# Altium schematic sheet 04_POWER_V1-0.SchDoc: RPi GS CAM SER.
size A3; Date: 2023-05-29; Author: M. Weimann; Organization: Altium Limited; Revision: 1.0; SheetNumber: 5; SheetTotal: 5; Title_Subtitle: Power Supplies; Language: DE; Department: F&E; Filename: RPi-GS-CAM-SER_PCB_V1-0.PDF; Project: PI-0017; DocType: Stromlauf; ItemNo-PCB: n/a
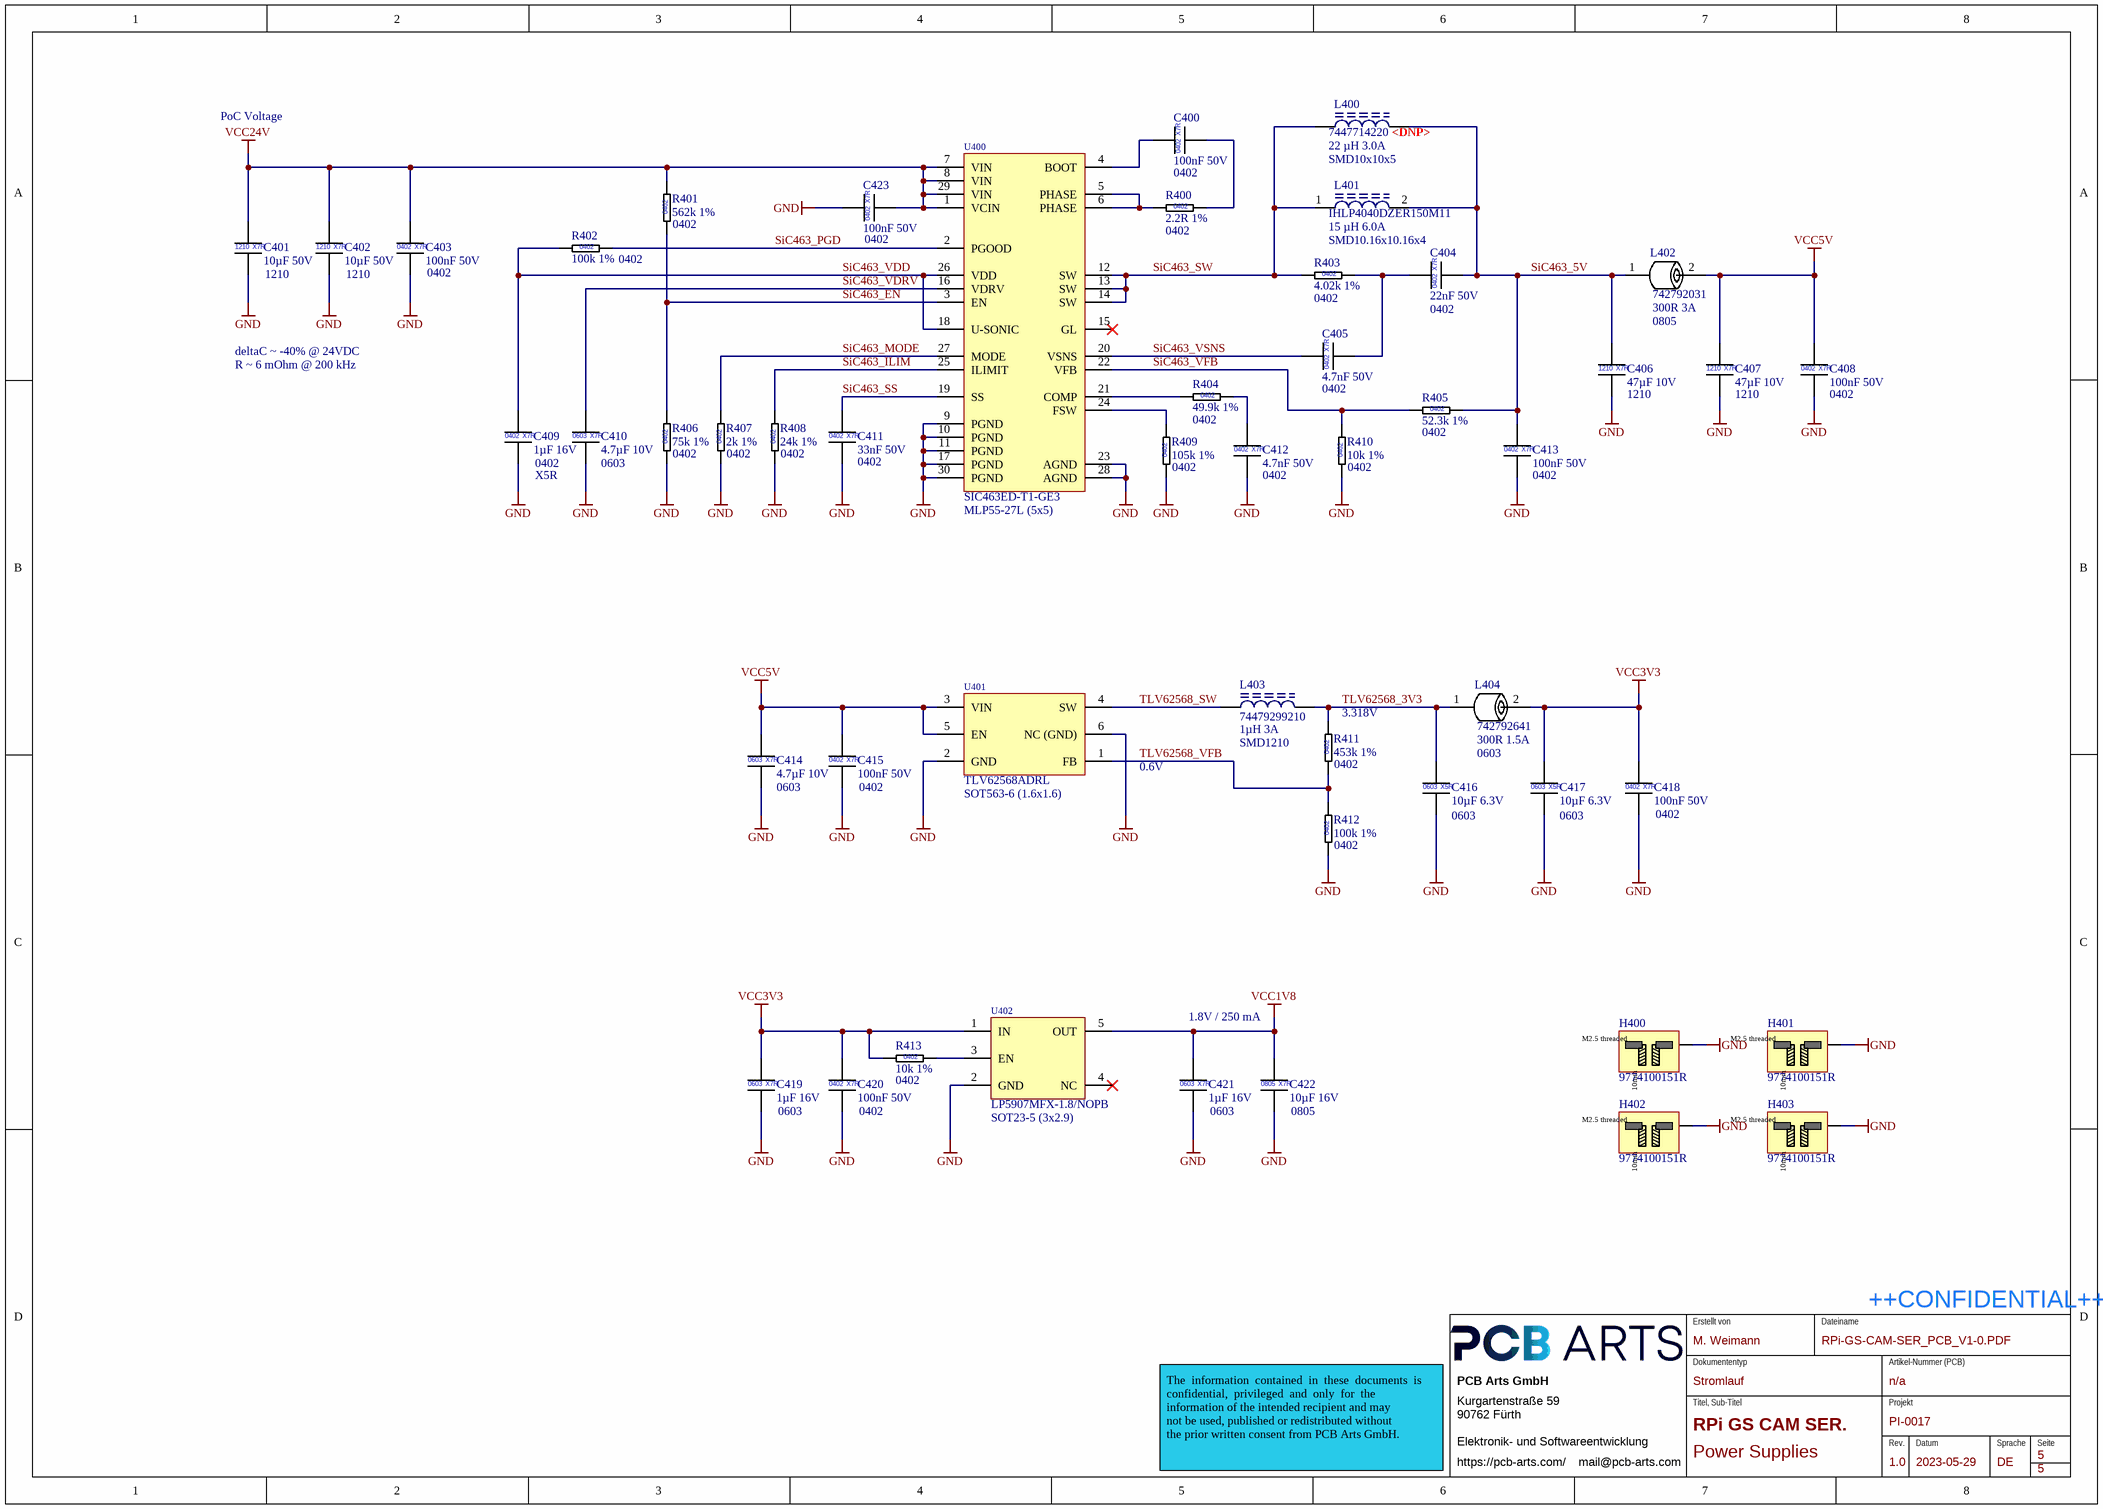
[diagram p0: 04_POWER_V1-0.SchDoc]

## Parts
C400  100nF 50V  [CAP_0402_L]
C401  10µF 50V  [CAP_1210]
C402  10µF 50V  [CAP_1210]
C403  100nF 50V  [CAP_0402_L]
C404  22nF 50V  [CAP_0402_L]
C405  4.7nF 50V  [CAP_0402_L]
C406  47µF 10V  [CAP_1210]
C407  47µF 10V  [CAP_1210]
C408  100nF 50V  [CAP_0402_L]
C409  1µF 16V  [CAP_0402_L]
C410  4.7µF 10V  [CAP_0603_L]
C411  33nF 50V  [CAP_0402_L]
C412  4.7nF 50V  [CAP_0402_L]
C413  100nF 50V  [CAP_0402_L]
C414  4.7µF 10V  [CAP_0603_L]
C415  100nF 50V  [CAP_0402_L]
C416  10µF 6.3V  [CAP_0603_L]
C417  10µF 6.3V  [CAP_0603_L]
C418  100nF 50V  [CAP_0402_L]
C419  1µF 16V  [CAP_0603_L]
C420  100nF 50V  [CAP_0402_L]
C421  1µF 16V  [CAP_0603_L]
C422  10µF 16V  [CAP_0805]
C423  100nF 50V  [CAP_0402_L]
H400  9774100151R  [9774100151R]
H401  9774100151R  [9774100151R]
H402  9774100151R  [9774100151R]
H403  9774100151R  [9774100151R]
L400  7447714220  [WE-PD_1050]  (no BOM)
L401  IHLP4040DZER150M11  [IHLP-4040DZ-11]
L402  742792031  [L_0805]
L403  74479299210  [WE-PMCI_1210]
L404  742792641  [L_0603]
R400  2.2R 1%  [RES_0402_L]
R401  562k 1%  [RES_0402_L]
R402  100k 1%  [RES_0402_L]
R403  4.02k 1%  [RES_0402_L]
R404  49.9k 1%  [RES_0402_L]
R405  52.3k 1%  [RES_0402_L]
R406  75k 1%  [RES_0402_L]
R407  2k 1%  [RES_0402_L]
R408  24k 1%  [RES_0402_L]
R409  105k 1%  [RES_0402_L]
R410  10k 1%  [RES_0402_L]
R411  453k 1%  [RES_0402_L]
R412  100k 1%  [RES_0402_L]
R413  10k 1%  [RES_0402_L]
U400  SIC463ED-T1-GE3  [VISHAY_MLP55-27L]
U401  TLV62568ADRL  [SON50P150X80-6N]
U402  LP5907MFX-1.8/NOPB  [SOT95P285X140-5N]

## Nets
GND: C401.2 C402.2 C403.2 C406.2 C407.2 C408.2 C409.2 C410.2 C411.2 C412.2 C413.2 C414.2 C415.2 C416.2 C417.2 C418.2 C419.2 C420.2 C421.2 C422.2 C423.1 H400.1 H401.1 H402.1 H403.1 R406.1 R407.1 R408.1 R409.1 R410.1 R412.1 U400.9(PGND) U400.10(PGND) U400.11(PGND) U400.17(PGND) U400.23(AGND) U400.28(AGND) U400.30(PGND) U401.2(GND) U401.6(NC_(GND)) U402.2(GND)
VCC1V8: C421.1 C422.1 U402.5(OUT)
VCC3V3: C417.1 C418.1 C419.1 C420.1 L404.2 R413.1 U402.1(IN)
VCC5V: C407.1 C408.1 C414.1 C415.1 L402.2 U401.3(VIN) U401.5(EN)
VCC24V: C401.1 C402.1 C403.1 C423.2 R401.2 U400.1(VCIN) U400.7(VIN) U400.8(VIN) U400.29(VIN)
SiC463_5V: C404.2 C406.1 C413.1 L400.2 L401.2 L402.1 R405.2
SiC463_EN: R401.1 R406.2 U400.3(EN)
SiC463_ILIM: R408.2 U400.25(ILIMIT)
SiC463_MODE: R407.2 U400.27(MODE)
SiC463_PGD: R402.2 U400.2(PGOOD)
SiC463_SS: C411.1 U400.19(SS)
SiC463_SW: L400.1 L401.1 R403.1 U400.12(SW) U400.13(SW) U400.14(SW)
SiC463_VDD: C409.1 R402.1 U400.18(U-SONIC) U400.26(VDD)
SiC463_VDRV: C410.1 U400.16(VDRV)
SiC463_VFB: R405.1 R410.2 U400.22(VFB)
SiC463_VSNS: C405.1 U400.20(VSNS)
TLV62568_3V3: C416.1 L403.2 L404.1 R411.2
TLV62568_SW: L403.1 U401.4(SW)
TLV62568_VFB: R411.1 R412.2 U401.1(FB)
NetC400_1: C400.1 U400.4(BOOT)
NetC400_2: C400.2 R400.2
NetC404_1: C404.1 C405.2 R403.2
NetC412_1: C412.1 R404.2
NetR400_1: R400.1 U400.5(PHASE) U400.6(PHASE)
NetR404_1: R404.1 U400.21(COMP)
NetR409_2: R409.2 U400.24(FSW)
NetR413_2: R413.2 U402.3(EN)

Not connected (* = marked no-connect by the designer): U400 15(GL)*; U402 4(NC)*

## Notes on the sheet
- PoC Voltage
- 0402
- (near L400) 22 µH 3.0A
- SMD10x10x5
- (near L400) <DNP>
- (near R401) 0402
- (near C423) 0402
- (near R400) 0402
- (near L401) 15 µH 6.0A
- SMD10.16x10.16x4
- (near C401) 1210
- (near C402) 1210
- (near C403) 0402
- (near R402) 0402
- (near R403) 0402
- (near C404) 0402
- (near L402) 300R 3A
- deltaC ~ -40% @ 24VDC
- R ~ 6 mOhm @ 200 kHz
- 0805
- (near R405) 0402
- (near C406) 1210
- (near C407) 1210
- (near C408) 0402
- X5R
- (near C410) 0603
- (near R406) 0402
- (near R407) 0402
- (near R408) 0402
- (near C411) 0402
- (near U400) MLP55-27L (5x5)
- (near R409) 0402
- (near C412) 0402
- (near R410) 0402
- (near C413) 0402
- (near R411) 3.318V
- 0.6V
- (near L403) 1µH 3A
- SMD1210
- (near R411) 0402
- 300R 1.5A
- 0603
- (near C414) 0603
- (near C415) 0402
- (near U401) SOT563-6 (1.6x1.6)
- (near R412) 0402
- (near C416) 0603
- (near C417) 0603
- (near C418) 0402
- 1.8V / 250 mA
- (near C419) 0603
- (near C420) 0402
- (near R413) 0402
- (near U402) SOT23-5 (3x2.9)
- (near C421) 0603
- (near C422) 0805
- Erstellt von
- Dateiname
- ++CONFIDENTIAL++
- PCB Arts GmbH
- Dokumententyp
- Artikel-Nummer (PCB)
- Kurgartenstraße 59
- 90762 Fürth
- Elektronik- und Softwareentwicklung
- Titel, Sub-Titel
- Projekt
- Rev.
- Datum
- Sprache
- Seite
- The  information  contained  in  these  documents  is  confidential,  privileged  and  only  for  the
  information of the intended recipient and may
  not be used, published or redistributed without
  the prior written consent from PCB Arts GmbH.
- https://pcb-arts.com/
- mail@pcb-arts.com
- (in symbol CAP_0402_1µF_16V) 0402; X7R
- (in symbol CAP_0402_4.7nF_50V_X7R_10%) X7R; 0402
- (in symbol CAP_0402_22nF_50V) X7R; 0402
- (in symbol CAP_0402_33nF_50V) 0402; X7R
- (in symbol CAP_0402_100nF_50V) 0402; X7R
- (in symbol CAP_0603_1µF_16V_X7R_10%) 0603; X7R
- (in symbol CAP_0603_4.7µF_10V_X7R_10%) 0603; X7R
- (in symbol CAP_0603_10µF_6.3V) 0603; X5R
- (in symbol CAP_0805_10µF_16V_X7R_10%) 0805; X7R
- (in symbol CAP_1210_10µF_50V_X7R_10%) 1210; X7R
- (in symbol CAP_1210_47µF_10V_X7R_10%) 1210; X7R
- (in symbol RES_0402_2.2R_1%) 0402
- (in symbol RES_0402_2k_1%) 0402
- (in symbol RES_0402_4.02k_1%) 0402
- (in symbol RES_0402_10k_1%) 0402
- (in symbol RES_0402_24k_1%) 0402
- (in symbol RES_0402_49.9k_1%) 0402
- (in symbol RES_0402_52.3k_1%) 0402
- (in symbol RES_0402_75k_1%) 0402
- (in symbol RES_0402_100k_1%) 0402
- (in symbol RES_0402_105k_1%) 0402
- (in symbol RES_0402_453k_1%) 0402
- (in symbol RES_0402_562k_1%) 0402
- (in symbol Würth Standoff M2.5 h:10mm) M2.5 threaded; 10mm

## Library data of the parts
C400 C403 C408 C413 C415 C418 C420 C423 = CAP_0402_100nF_50V: Multilayer Ceramic Capacitors MLCC - SMD/SMT 0402 50VDC; Manufacturer 1: Murata Electronics; Manufacturer 1 Prt. Nr.: GCM155L8EH104KE07D; Manufacturer 2 Prt. Nr.: UMK105B7104KV-FR; Manufacturer 2: TDK
C401 C402 = CAP_1210_10µF_50V_X7R_10%: Multilayer Ceramic Capacitors MLCC - SMD/SMT 10 uF 50 VDC 10% 1210 X7R; Manufacturer 1: Murata Electronics; Manufacturer 1 Prt. Nr.: GRJ32ER71H106KE11L; Manufacturer 2 Prt. Nr.: C1210C106K5RACTU; Manufacturer 2: KEMET
C404 = CAP_0402_22nF_50V: Multilayer Ceramic Capacitors MLCC - SMD/SMT 0402 50VDC; Manufacturer 1: Murata; Manufacturer 1 Prt. Nr.: GRT155R71H223KE01D; Manufacturer 2 Prt. Nr.: 0402B223K500CT; Manufacturer 2: Walsin
C405 C412 = CAP_0402_4.7nF_50V_X7R_10%: Multilayer Ceramic Capacitors MLCC - SMD/SMT 50V 0.022uF X7R 0402 10%; Manufacturer 1: Murata Electronics; Manufacturer 1 Prt. Nr.: GCM155R71H472KA37J; Manufacturer 2 Prt. Nr.: C0402C472K5RAC7411; Manufacturer 2: KEMET
C406 C407 = CAP_1210_47µF_10V_X7R_10%: Multilayer Ceramic Capacitors MLCC - SMD/SMT 47 uF 10 VDC 10% 1210 X7R; Manufacturer 1: Murata Electronics; Manufacturer 1 Prt. Nr.: GRM32ER71A476KE15L; Manufacturer 2 Prt. Nr.: C1210C106K8RACTU; Manufacturer 2: KEMET
C409 = CAP_0402_1µF_16V: Multilayer Ceramic Capacitors MLCC - SMD/SMT 0402 16VDC; Manufacturer 1: Taiyo Yuden; Manufacturer 1 Prt. Nr.: EMK105BJ105MVHF; Manufacturer 2 Prt. Nr.: GRM155R61E105KA12D; Manufacturer 2: Murata Electronics
C410 C414 = CAP_0603_4.7µF_10V_X7R_10%: Multilayer Ceramic Capacitors MLCC - SMD/SMT 4.7 uF 10 VDC 10% 0603 X7R; Manufacturer 1: Murata Electronics; Manufacturer 1 Prt. Nr.: GRM188Z71A475KE15D; Manufacturer 2 Prt. Nr.: 0603B475K100NT; Manufacturer 2: FH (Guangdong Fenghua Advanced Tech)
C411 = CAP_0402_33nF_50V: Multilayer Ceramic Capacitors MLCC - SMD/SMT 0402 50VDC; Manufacturer 1: Murata; Manufacturer 1 Prt. Nr.: GRT155R71H333KE01D; Manufacturer 2 Prt. Nr.: CC0402KRX7R9BB333; Manufacturer 2: Yageo
C416 C417 = CAP_0603_10µF_6.3V: Multilayer Ceramic Capacitors MLCC - SMD/SMT 0603 6.3VDC; Manufacturer 1: Murata Electronics; Manufacturer 1 Prt. Nr.: GRM188R60J106ME84J; Manufacturer 2 Prt. Nr.: JMK107ABJ106MA-T; Manufacturer 2: Taiyo Yuden
C419 C421 = CAP_0603_1µF_16V_X7R_10%: Multilayer Ceramic Capacitors MLCC - SMD/SMT 0603 16VDC 1uF 10% X7R 0.8mm; Manufacturer 1: TDK; Manufacturer 1 Prt. Nr.: C1608X7R1C105K080AC; Manufacturer 2 Prt. Nr.: C0603C105K4RACTU; Manufacturer 2: KEMET
C422 = CAP_0805_10µF_16V_X7R_10%: Multilayer Ceramic Capacitors MLCC - SMD/SMT 16V 10uF X7R 0805 10%; Manufacturer 1: KYOCERA AVX; Manufacturer 1 Prt. Nr.: 0805YC106KAT2A; Manufacturer 2 Prt. Nr.: CL21B106KOQNNNG; Manufacturer 2: Samsung Electro-Mechanics
H400-H403 = Würth Standoff M2.5 h:10mm: Würth Standoff M2.5 h:10mm 9774050151R; Manufacturer 1: Würth Elektronik; Manufacturer 1 Prt. Nr.: 9774100151R
L400 = 7447714220_22uH_20%_3.0A_50mΩ_SMD: Power Inductors - SMD WE-PD 22uH 3A DCR=50mOhms; Manufacturer 1: Wurth Elektronik; Manufacturer 1 Prt. Nr.: 7447714220; ClassName: ComponentsOverlap
L401 = IHLP4040DZER150M11_15uH_20%_6.0A_45mΩ_SMD: 15uH ±20% 6A 45mΩ SMD,10.16x10.16x4mm Power Inductor; Manufacturer 1: Visay Dale; Manufacturer 1 Prt. Nr.: IHLP4040DZER150M11; ClassName: ComponentsOverlap
L402 = 742792031 _Ferrite_Beads_0805_300Ohms_3000mA: Ferrite Beads WE-CBF 0805 200MHz 300Ohm 3000mA AEC-Q200; Manufacturer 1: Wurth Elektronik; Manufacturer 1 Prt. Nr.: 742792031
L403 = 74479299210_Fixed_Inductors_1.0uH_30%_3A_SMD1210: Fixed Power Inductor - SMD WE-PMCI 1210 1.0uH 3A 38mOhms 30%Tol; Manufacturer 1: Wurth Elektronik; Manufacturer 1 Prt. Nr.: 74479299210
L404 = 742792641_Ferrite_Beads_0603_300Ohms_1500mA: Ferrite Beads WE-CBF 0603 100MHz 300Ohm 2000mA AEC-Q200; Manufacturer 1: Wurth Elektronik; Manufacturer 1 Prt. Nr.: 742792641
R400 = RES_0402_2.2R_1%: Thick Film Resistors - SMD 2.2Ohm 1%; Manufacturer 1: Vishay / Dale; Manufacturer 1 Prt. Nr.: CRCW04022R20JNED; Manufacturer 2 Prt. Nr.: RC0402FR-7W2R2L; Manufacturer 2: Yageo
R401 = RES_0402_562k_1%: Thick Film Resistors - SMD 562kOhms 62.5mW 0402 1%; Manufacturer 1: Vishay / Dale; Manufacturer 1 Prt. Nr.: CRCW0402562KFKEDC; Manufacturer 2 Prt. Nr.: AC0402FR-07562KL; Manufacturer 2: Yageo
R402 R412 = RES_0402_100k_1%: Thick Film Resistors - SMD 100kOhm 1%; Manufacturer 1: Vishay / Dale; Manufacturer 1 Prt. Nr.: CRCW0402100KFKEDC; Manufacturer 2 Prt. Nr.: RC0402FR-7W100KL; Manufacturer 2: Yageo
R403 = RES_0402_4.02k_1%: Thick Film Resistors - SMD 4.02kOhm 1%; Manufacturer 1: Vishay / Dale; Manufacturer 1 Prt. Nr.: CRCW04024K02FKEDC; Manufacturer 2 Prt. Nr.: RC0402FR-134K02L; Manufacturer 2: Yageo
R404 = RES_0402_49.9k_1%: Thick Film Resistors - SMD 49.9kOhm 1%; Manufacturer 1: Vishay / Dale; Manufacturer 1 Prt. Nr.: CRCW040249K9FKEDC; Manufacturer 2 Prt. Nr.: RC0402FR-7W49K9L; Manufacturer 2: Yageo
R405 = RES_0402_52.3k_1%: Thick Film Resistors - SMD 52.3kOhm 1%; Manufacturer 1: Vishay / Dale; Manufacturer 1 Prt. Nr.: CRCW040252K3FKEDC; Manufacturer 2 Prt. Nr.: RC0402FR-1352K3L; Manufacturer 2: Yageo
R406 = RES_0402_75k_1%: Thick Film Resistors - SMD 75kOhm 1%; Manufacturer 1: Vishay / Dale; Manufacturer 1 Prt. Nr.: CRCW040275K0FKEDC; Manufacturer 2 Prt. Nr.: AC0402FR-0775KL; Manufacturer 2: Yageo
R407 = RES_0402_2k_1%: Thick Film Resistors - SMD 2 kOhms 62.5mW 0402 1%; Manufacturer 1: Vishay / Dale; Manufacturer 1 Prt. Nr.: CRCW04022K00FKEDC; Manufacturer 2 Prt. Nr.: RC0402FR-072KL; Manufacturer 2: Yageo
R408 = RES_0402_24k_1%: Thick Film Resistors - SMD 24kOhm 1%; Manufacturer 1: Vishay / Dale; Manufacturer 1 Prt. Nr.: CRCW040224K0FKEDC; Manufacturer 2 Prt. Nr.: RC0402FR-7W24KL; Manufacturer 2: Yageo
R409 = RES_0402_105k_1%: Thick Film Resistors - SMD 105kOhm 1%; Manufacturer 1: Vishay / Dale; Manufacturer 1 Prt. Nr.: CRCW0402105KFKEDC; Manufacturer 2 Prt. Nr.: RC0402FR-13105KL; Manufacturer 2: Yageo
R410 R413 = RES_0402_10k_1%: Thick Film Resistors - SMD 10kOhm 1%; Manufacturer 1: Vishay / Dale; Manufacturer 1 Prt. Nr.: CRCW040210K0FKEDC; Manufacturer 2 Prt. Nr.: RC0402FR-7W10KL; Manufacturer 2: Yageo
R411 = RES_0402_453k_1%: Thick Film Resistors - SMD 1/16watt 453Kohms 1%; Manufacturer 1: Vishay / Dale; Manufacturer 1 Prt. Nr.: CRCW0402453KFKED; Manufacturer 2 Prt. Nr.: CR0402-FX-4533GLF; Manufacturer 2: Bourns
U400 = SIC463ED-T1-GE3_Switching_Voltage_Regulator_4A: Switching Voltage Regulators 4A, 4.5-60V buck reg 100kHZ to 2MHz; 5 mm x 5 mm MLP55-27L package; Manufacturer 1: Vishay Siliconix; Manufacturer 1 Prt. Nr.: SIC463ED-T1-GE3
U401 = TLV62568ADRL_Step Down Converter 1A; 2A: Step Down Converter with Forced PWM in SOT563 Package; Manufacturer 1: Texas Instruments; Manufacturer 1 Prt. Nr.: TLV62568ADRL
U402 = LP5907MFX-1.8/NOPB_LDO_Voltage_Regulators_250mA: LDO Spannungs-Regulator 250mA Ultra-Lo Noise LDO Reg SOT23-5; Manufacturer 1: Texas Instruments; Manufacturer 1 Prt. Nr.: LP5907MFX-1.8/NOPB